# EAGLE board ES_Daisy_Patch_Rev8 (EAGLE 9.6.2), part 1 of 2
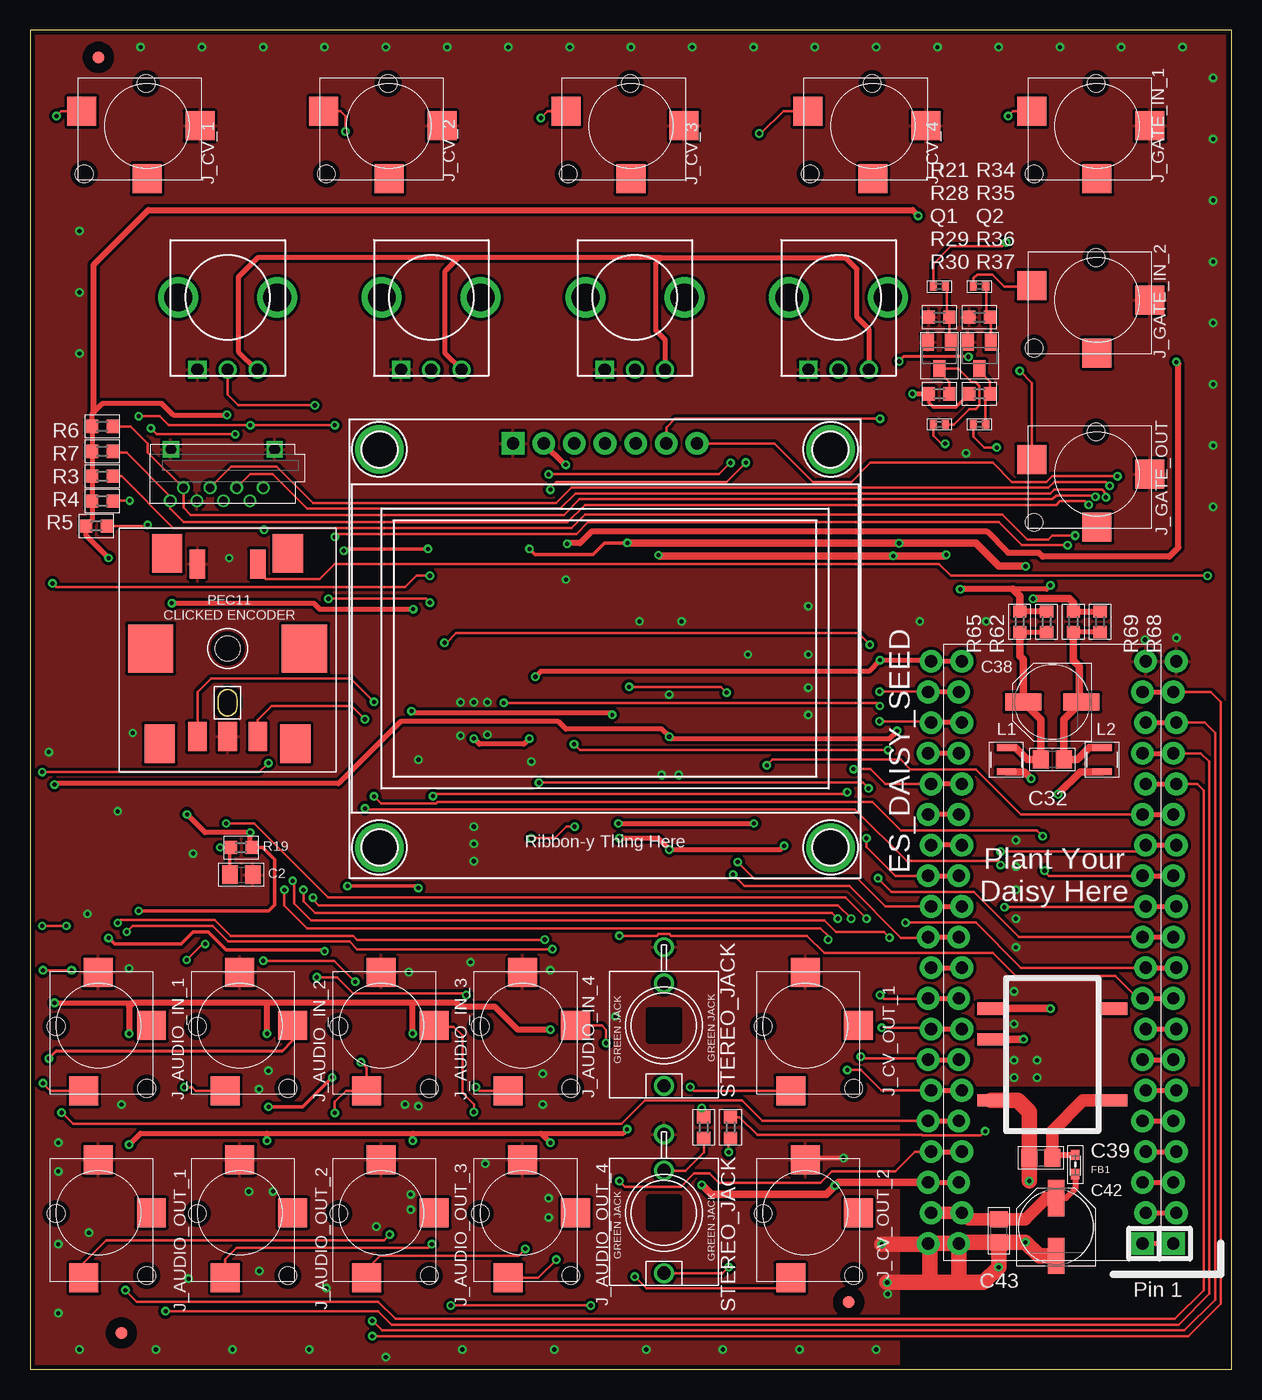
[diagram p4: board, top side]
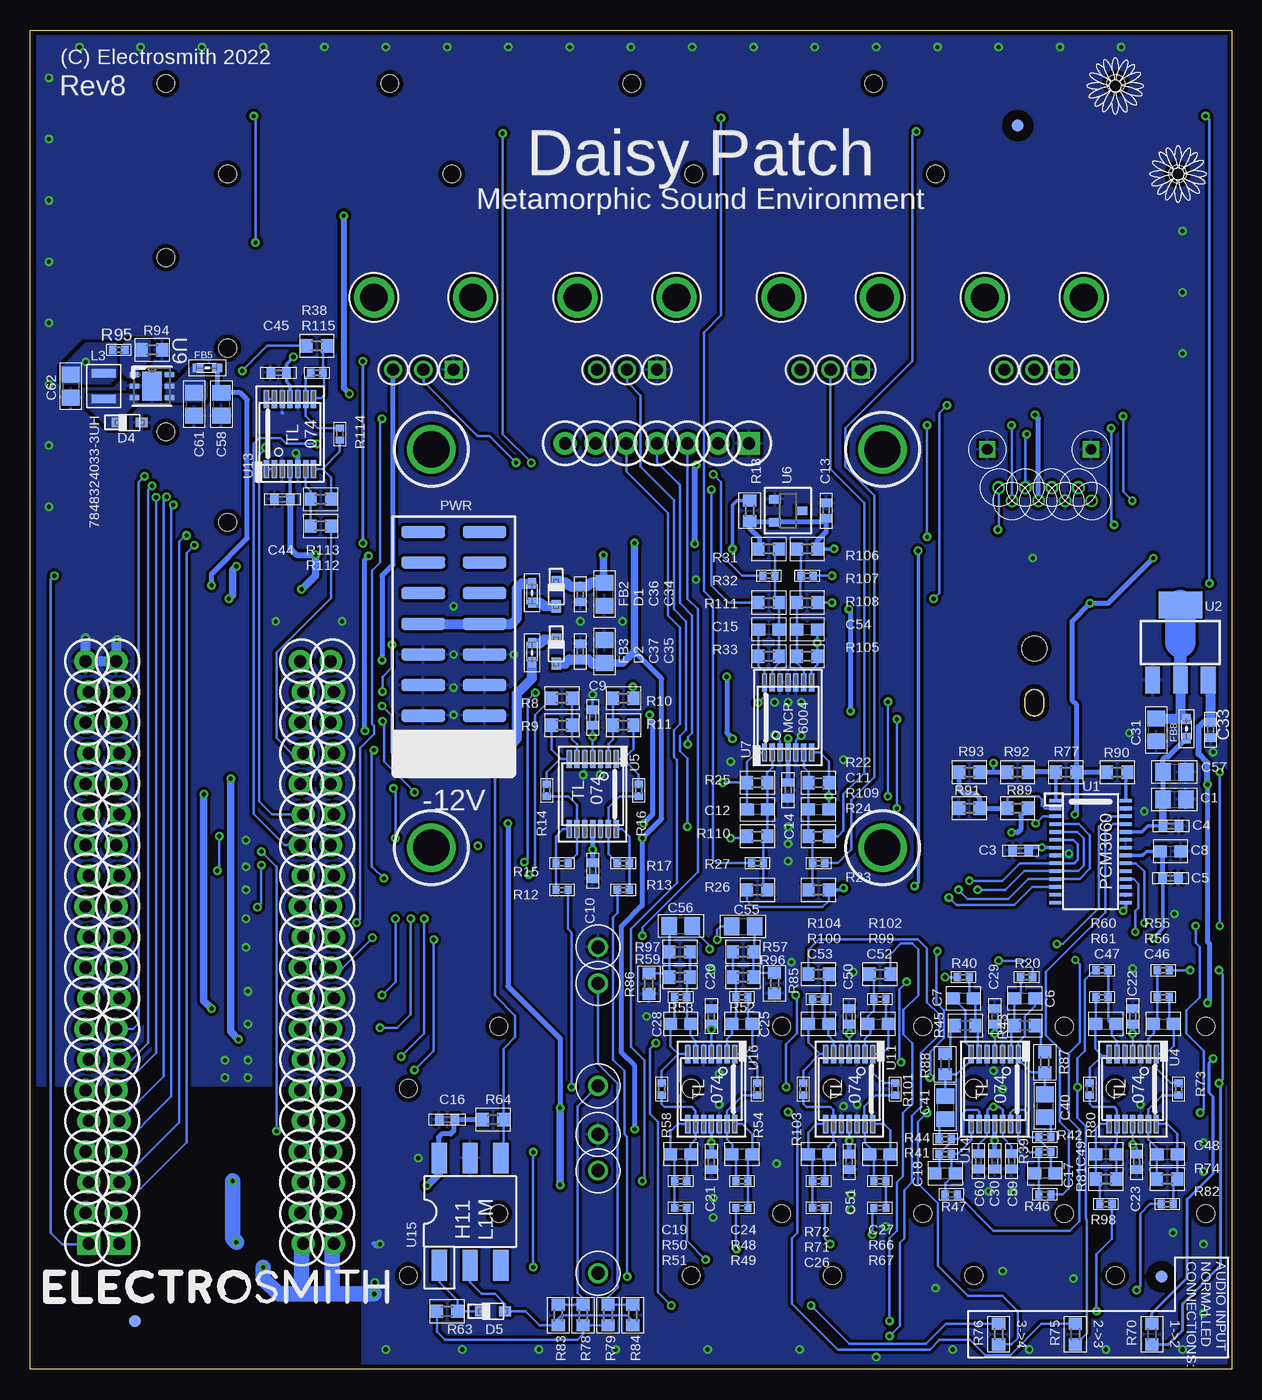
[diagram p5: board, bottom side, seen from below]

Size 99.6 x 111 mm. Coordinates in mm from the lower left corner, seen from the top.
Outline: 0,0 99.6,0 99.6,111 0,111 0,0
Copper layers (1*16): Top 0.0356mm / dielectric 1.5011mm / Bottom 0.0356mm
Design rules "ES_DRC_MaskedVias *": minimum track width 6mil, minimum drill 13mil, track to track 6mil, track to pad 6mil, pad to pad 6mil, via to via 6mil, smd to smd 6mil, copper to edge 15mil, drill to drill 6mil, minimum pad ring 7mil, minimum via ring 7mil, stop-mask expansion 3mil, vias tented up to drill 16mil, thermal gap 10mil
Net classes: 0 default: width 0.203 mm; 1 POWER: width 0.102 mm, clearance 0.102 mm; 7 CODEC: width 0.102 mm, drill 0.2 mm; 8 SAI: width 0.102 mm, drill 0.2 mm; 9 AGND: clearance 0.102 mm

## Footprints (pad centres in the part's own frame; a part is rotated, then mirrored left to right if it is on the bottom)
C0805 = smd 1.3 x 1.5: 1 -0.95,0; 2 0.95,0
C0402 = smd 0.7 x 0.9: 1 -0.65,0; 2 0.65,0
C0603 = smd 1.1 x 1: 1 -0.85,0; 2 0.85,0
PANASONIC_D = smd 3 x 1.4: + 2.4,0; - -2.4,0
SOD-323F = smd 1 x 0.8: A 1,0; C -1,0
VH1-147 = smd 1.55 x 2.4: A -2.5,-7.3; B 2.5,-7.3; C 0,-7.3 | smd 1.3 x 2.4: D -2.5,7; E 2.5,7 | smd 3.75 x 4: GND1 -6.375,0; GND2 6.375,0 | smd 2.5 x 3.2: GND3 -5.625,-7.9; GND4 5.625,-7.9; GND5 -5,7.9; GND6 5,7.9 | hole 2.05: 0,0
2X8_SMD_PWR = smd 3.642 x 1: 1 -2.54,8.89; 2 2.54,8.89; 3 -2.54,6.35; 4 2.54,6.35; 5 -2.54,3.81; 6 2.54,3.81; 7 -2.54,1.27; 8 2.54,1.27; 9 -2.54,-1.27; 10 2.54,-1.27; 11 -2.54,-3.81; 12 2.54,-3.81; 13 -2.54,-6.35; 14 2.54,-6.35; 15 -2.54,-8.89; 16 2.54,-8.89
WUERTH-ELEKTRONIK_0603 = smd 0.85 x 0.7: 1 -0.9,0; 2 0.7,0
FIDUCIAL_1MM = smd 1 x 1: 1 0,0
SMT_JACK = smd 2.4 x 2.4: 1 -4.4,0; 2 0,4.4; 3 5.4,-1.2 | hole 1.45: 5.2,4; 0.07,-3.5
STEREO_JACK_3.5MM = drill 1.1: GND 0,-6.5; RING 0,-3.5; TIP 0,5
BOURNS_SRP2010 = smd 0.559 x 1.6: P$1 -1.003,0; P$2 1.003,0
I1008 = smd 0.7 x 2: 1 1.05,0; 2 -1.05,0
SOT23-BEC = smd 1 x 1.4: B -0.95,-1.1; C 0,1.1; E 0.95,-1.1
R0603 = smd 1 x 1.1: 1 -0.85,0; 2 0.85,0
R0402 = smd 0.6 x 0.7: 1 -0.5,0; 2 0.5,0
TSSOP-28 = smd 0.305 x 0.991: 1 -4.225,-2.918; 2 -3.575,-2.918; 3 -2.925,-2.918; 4 -2.275,-2.918; 5 -1.625,-2.918; 6 -0.975,-2.918; 7 -0.325,-2.918; 8 0.325,-2.918; 9 0.975,-2.918; 10 1.625,-2.918; 11 2.275,-2.918; 12 2.925,-2.918; 13 3.575,-2.918; 14 4.225,-2.918; 15 4.225,2.918; 16 3.575,2.918; 17 2.925,2.918; 18 2.275,2.918; 19 1.625,2.918; 20 0.975,2.918; 21 0.325,2.918; 22 -0.325,2.918; 23 -0.975,2.918; 24 -1.625,2.918; 25 -2.275,2.918; 26 -2.925,2.918; 27 -3.575,2.918; 28 -4.225,2.918
SOT223 = smd 2.235 x 1.219: 1 3.099,-2.311; 2 3.099,0; 3 3.099,2.311 | smd 2.2 x 3.6: TAB -3.099,0
VERT_MICROSD_CENTERED = drill 0.9 square: GND1 -3.9,-1.55; GND2 4.7,-1.55 | drill 0.7: P$1 -2.95,1.62; P$2 -1.85,2.72; P$3 -0.75,1.62; P$4 0.35,2.72; P$5 1.45,1.62; P$6 2.55,2.72; P$7 3.65,1.62; P$8 4.75,2.72
TSSOP-14 = smd 0.45 x 1.5: 1 -1.95,-2.9; 2 -1.3,-2.9; 3 -0.65,-2.9; 4 0,-2.9; 5 0.65,-2.9; 6 1.3,-2.9; 7 1.95,-2.9; 8 1.95,2.9; 9 1.3,2.9; 10 0.65,2.9; 11 0,2.9; 12 -0.65,2.9; 13 -1.3,2.9; 14 -1.95,2.9
DBZ_R-PDSO-G3 = smd 0.7 x 1: 1 -0.95,-1.1; 2 0.95,-1.1; 3 0,1.1
DFN06_3X3_STM = smd 0.813 x 0.406: 1 -1.448,0.95; 2 -1.448,0; 3 -1.448,-0.95; 4 1.448,-0.95; 5 1.448,0; 6 1.448,0.95 | smd 1.6 x 2.413: 7 0,0
DIL06_GULLWING = smd 1.27 x 2.54: 1 -2.54,-4.445; 2 0,-4.445; 3 2.54,-4.445; 4 2.54,4.445; 5 0,4.445; 6 -2.54,4.445
XP_POWER_ISEXXXXA = smd 1 x 2.28: P$1 -3.81,-5.08; P$2 -1.27,-5.08; P$4 3.81,-5.08; P$5 3.81,5.08; P$8 -3.81,5.08
ES_DAISY_SEED_DOUBLE = drill 1.016 pad 1.88 square: 1 -7.493,24.13; B1 -10.033,24.13 | drill 1.016 pad 1.88: 2 -7.747,21.59; 3 -7.493,19.05; 4 -7.747,16.51; 5 -7.493,13.97; 6 -7.747,11.43; 7 -7.493,8.89; 8 -7.747,6.35; 9 -7.493,3.81; 10 -7.747,1.27; 11 -7.493,-1.27; 12 -7.747,-3.81; 13 -7.493,-6.35; 14 -7.747,-8.89; 15 -7.493,-11.43; 16 -7.747,-13.97; 17 -7.493,-16.51; 18 -7.747,-19.05; 19 -7.493,-21.59; 20 -7.747,-24.13; 21 7.493,-24.13; 22 7.747,-21.59; 23 7.493,-19.05; 24 7.747,-16.51; 25 7.493,-13.97; 26 7.747,-11.43; 27 7.493,-8.89; 28 7.747,-6.35; 29 7.493,-3.81; 30 7.747,-1.27; 31 7.493,1.27; 32 7.747,3.81; 33 7.493,6.35; 34 7.747,8.89; 35 7.493,11.43; 36 7.747,13.97; 37 7.493,16.51; 38 7.747,19.05; 39 7.493,21.59; 40 7.747,24.13; B2 -10.287,21.59; B3 -10.033,19.05; B4 -10.287,16.51; B5 -10.033,13.97; B6 -10.287,11.43; B7 -10.033,8.89; B8 -10.287,6.35; B9 -10.033,3.81; B10 -10.287,1.27; B11 -10.033,-1.27; B12 -10.287,-3.81; B13 -10.033,-6.35; B14 -10.287,-8.89; B15 -10.033,-11.43; B16 -10.287,-13.97; B17 -10.033,-16.51; B18 -10.287,-19.05; B19 -10.033,-21.59; B20 -10.287,-24.13; B21 10.033,-24.13; B22 10.287,-21.59; B23 10.033,-19.05; B24 10.287,-16.51; B25 10.033,-13.97; B26 10.287,-11.43; B27 10.033,-8.89; B28 10.287,-6.35; B29 10.033,-3.81; B30 10.287,-1.27; B31 10.033,1.27; B32 10.287,3.81; B33 10.033,6.35; B34 10.287,8.89; B35 10.033,11.43; B36 10.287,13.97; B37 10.033,16.51; B38 10.287,19.05; B39 10.033,21.59; B40 10.287,24.13
ER-OLEDM015-2 = drill 1.016 pad 1.88 square: 1 -7.62,17 | drill 1.016 pad 1.88: 2 -5.08,17; 3 -2.54,17; 4 0,17; 5 2.54,17; 6 5.08,17; 7 7.62,17 | drill 3 pad 4.013: MNT1 -18.7,16.5; MNT2 18.7,16.5; MNT3 -18.7,-16.5; MNT4 18.7,-16.5
PIP_POT_PASTE6 = drill 1 pad 1.422 square: 1 -2.5,-6 | drill 1 pad 1.422: 2 0,-6; 3 2.5,-6 | drill 2.3: S1 -4.1,0; S2 4.1,0

## Placement (x,y rotation side)
C1  10UF  [C0805]  4.75,47.25 0 bottom
C2  10UF  [C0805]  17.5,41 0 top
C3  100NF  [C0402]  17.5,43 180 bottom
C4  100NF  [C0402]  5.03,45.03 0 bottom
C5  100NF  [C0402]  5.07,40.72 0 bottom
C6  47PF  [C0603]  17.15,30.75 0 bottom
C7  47PF  [C0603]  22.25,30.75 180 bottom
C8  2.2UF  [C0603]  5.07,42.94 0 bottom
C9  100NF  [C0402]  52.98,54.03 90 bottom
C10  100NF  [C0402]  52.98,41.33 90 bottom
C11  10NF  [C0603]  34.24,46.41 0 bottom
C12  10NF  [C0603]  39.32,46.41 180 bottom
C13  100NF  [C0402]  33.61,71.17 90 bottom
C14  100NF  [C0402]  36.78,48 270 bottom
C15  10NF  [C0603]  38.37,61.33 180 bottom
C16  100NF  [C0402]  65.04,20.69 180 bottom
C17  47PF  [C0603]  15.5,16.25 180 bottom
C18  47PF  [C0603]  23.75,16.25 0 bottom
C19  47PF  [C0603]  45.67,17.83 180 bottom
C20  100NF  [C0402]  43.13,29.26 90 bottom
C21  100NF  [C0402]  43.13,17.2 90 bottom
C22  100NF  [C0402]  8.21,29.26 90 bottom
C23  100NF  [C0402]  7.89,17.2 90 bottom
C24  47PF  [C0603]  40.59,17.83 0 bottom
C25  47PF  [C0603]  40.59,28.63 0 bottom
C26  47PF  [C0603]  34.24,17.83 180 bottom
C27  47PF  [C0603]  29.16,17.83 0 bottom
C28  47PF  [C0603]  45.67,28.63 180 bottom
C29  100NF  [C0402]  19.64,29.26 90 bottom
C30  100NF  [C0402]  19.64,17.25 90 bottom
C31  10UF  [C0805]  6.25,53 270 bottom
C32  10UF  [C0805]  84.72,50.53 180 top
C33  100NF  [C0402]  1.75,53 270 bottom
C34  10UF  [C0805]  52,64.25 270 bottom
C35  10UF  [C0805]  52,59.5 270 bottom
C36  100NF  [C0402]  54,64.25 270 bottom
C37  100NF  [C0402]  54,59.5 270 bottom
C38  220uF  [PANASONIC_D]  84.72,55.3 180 top
C39  10UF  [C0805]  83.77,17.52 0 top
C40  10UF  [C0805]  15.5,21.85 270 bottom
C41  10UF  [C0805]  23.75,21.7 270 bottom
C42  220uF  [PANASONIC_D]  85.04,11.8 90 top
C43  10UF  [C0805]  80.28,11.48 90 top
C44  100NF  [C0402]  78.69,72.12 180 bottom
C45  100NF  [C0402]  79.01,82.6 0 bottom
C46  47PF  [C0603]  5.67,28.63 0 bottom
C47  47PF  [C0603]  10.44,28.63 180 bottom
C48  560PF  [C0603]  5.35,17.83 0 bottom
C49  560PF  [C0603]  10.43,17.83 180 bottom
C50  100NF  [C0402]  31.7,29.26 90 bottom
C51  100NF  [C0402]  31.7,17.2 90 bottom
C52  47PF  [C0603]  29.31,28.63 0 bottom
C53  47PF  [C0603]  34.24,28.63 180 bottom
C54  10NF  [C0603]  35.2,61.33 0 bottom
C55  10UF  [C0805]  40.5,36.7 0 bottom
C56  10UF  [C0805]  45.67,36.75 180 bottom
C57  10UF  [C0805]  4.75,49.5 0 bottom
C58  10UF  [C0805]  83.75,80 270 bottom
C59  100NF  [C0402]  18.25,17.25 270 bottom
C60  100NF  [C0402]  21,17.25 270 bottom
C61  10UF  [C0805]  86,80 270 bottom
C62  10UF  [C0805]  96.25,81.5 270 bottom
D1  NSR1020MW2T3G  [SOD-323F]  56,64.25 270 bottom
D2  NSR1020MW2T3G  [SOD-323F]  56,59.5 270 bottom
D4  NSR1020MW2T3G  [SOD-323F]  91.36,78.48 0 bottom
D5  1N4148  [SOD-323F]  61.23,4.81 0 bottom
ENC_1  ENCODER_SMT  [VH1-147]  16.36,59.75 0 top
EP1  EURORACK_POWERSMT_2X8  [2X8_SMD_PWR]  64.48,60.52 0 bottom
FB1  FB  [WUERTH-ELEKTRONIK_0603]  86.63,16.88 270 top
FB2  FB  [WUERTH-ELEKTRONIK_0603]  58,64.25 270 bottom
FB3  FB  [WUERTH-ELEKTRONIK_0603]  58,59.5 90 bottom
FB5  FB 0603  [WUERTH-ELEKTRONIK_0603]  85,83 180 bottom
FB8  FERRITE_BEAD_0603  [WUERTH-ELEKTRONIK_0603]  3.75,53 270 bottom
FD1  FIDUCIAL  [FIDUCIAL_1MM]  5.65,108.75 0 top
FD2  FIDUCIAL  [FIDUCIAL_1MM]  7.56,3.02 0 top
FD3  FIDUCIAL  [FIDUCIAL_1MM]  67.85,5.56 0 top
FD4  FIDUCIAL  [FIDUCIAL_1MM]  17.73,103.08 0 bottom
FD5  FIDUCIAL  [FIDUCIAL_1MM]  5.83,7.67 0 bottom
FD6  FIDUCIAL  [FIDUCIAL_1MM]  90.92,4.02 0 bottom
J_AUDIO_IN_1  EURO_JACK_SMT  [SMT_JACK]  5.65,28.5 270 top
J_AUDIO_IN_2  EURO_JACK_SMT  [SMT_JACK]  17.37,28.5 270 top
J_AUDIO_IN_3  EURO_JACK_SMT  [SMT_JACK]  29.09,28.5 270 top
J_AUDIO_IN_4  EURO_JACK_SMT  [SMT_JACK]  40.81,28.5 270 top
J_AUDIO_OUT_1  EURO_JACK_SMT  [SMT_JACK]  5.65,12.97 270 top
J_AUDIO_OUT_2  EURO_JACK_SMT  [SMT_JACK]  17.37,12.97 270 top
J_AUDIO_OUT_3  EURO_JACK_SMT  [SMT_JACK]  29.09,12.97 270 top
J_AUDIO_OUT_4  EURO_JACK_SMT  [SMT_JACK]  40.81,12.97 270 top
J_CV_1  EURO_JACK_SMT  [SMT_JACK]  9.69,103.07 180 top
J_CV_2  EURO_JACK_SMT  [SMT_JACK]  29.74,103.07 180 top
J_CV_3  EURO_JACK_SMT  [SMT_JACK]  49.8,103.07 180 top
J_CV_4  EURO_JACK_SMT  [SMT_JACK]  69.86,103.07 180 top
J_CV_OUT_1  EURO_JACK_SMT  [SMT_JACK]  64.25,28.5 270 top
J_CV_OUT_2  EURO_JACK_SMT  [SMT_JACK]  64.25,12.97 270 top
J_GATE_IN_1  EURO_JACK_SMT  [SMT_JACK]  88.42,103.07 180 top
J_GATE_IN_2  EURO_JACK_SMT  [SMT_JACK]  88.42,88.64 180 top
J_GATE_OUT  EURO_JACK_SMT  [SMT_JACK]  88.42,74.21 180 top
J_MIDI_IN  STEREO_JACK  [STEREO_JACK_3.5MM]  52.53,28.5 180 top
J_MIDI_OUT  STEREO_JACK  [STEREO_JACK_3.5MM]  52.53,12.97 180 top
L1  2.2uH  [BOURNS_SRP2010]  80.92,50.53 270 top
L2  2.2uH  [BOURNS_SRP2010]  88.85,50.53 270 top
L3  7848324033-3UH  [I1008]  93.5,81.5 270 bottom
Q1  MMBT3904  [SOT23-BEC]  75.36,84.03 180 top
Q2  MMBT3904  [SOT23-BEC]  78.69,84.03 180 top
R1  33R  [R0603]  55.83,20.06 270 top
R2  10R  [R0603]  58.05,20.06 90 top
R3  47K  [R0603]  5.99,74.03 180 top
R4  47K  [R0603]  5.99,71.97 180 top
R5  47K  [R0603]  5.49,69.9 180 top
R6  47K  [R0603]  5.99,78.16 180 top
R7  47K  [R0603]  5.99,76.09 180 top
R8  33K  [R0603]  55.52,55.61 180 bottom
R9  49K9  [R0603]  55.52,53.39 0 bottom
R10  33K  [R0603]  50.44,55.61 0 bottom
R11  49K9  [R0603]  50.44,53.39 180 bottom
R12  1K  [R0402]  55.52,39.74 180 bottom
R13  1K  [R0402]  50.44,39.74 0 bottom
R14  100K  [R0402]  56.78,48 90 bottom
R15  100K  [R0402]  55.52,41.96 0 bottom
R16  100K  [R0402]  49.16,48 90 bottom
R17  100K  [R0402]  50.44,41.96 180 bottom
R18  2K  [R0603]  39.96,71.17 90 bottom
R19  5R1  [R0603]  17.5,43.25 0 top
R20  100K  [R0402]  17,32.5 180 bottom
R21  100K  [R0402]  75.36,89.75 0 top
R22  66K5  [R0603]  34.24,48.63 0 bottom
R23  200K  [R0603]  34.24,39.74 180 bottom
R24  100K  [R0402]  34.24,41.96 180 bottom
R25  66K5  [R0603]  39.32,48.63 180 bottom
R26  200K  [R0603]  39.32,39.74 0 bottom
R27  100K  [R0402]  39.32,41.96 0 bottom
R28  1M  [R0603]  75.36,87.21 0 top
R29  10K  [R0603]  75.36,80.86 180 top
R30  1K  [R0402]  75.36,78.32 0 top
R31  200K  [R0603]  38.37,68 0 bottom
R32  100K  [R0402]  38.37,65.78 0 bottom
R33  66K5  [R0603]  38.37,59.11 180 bottom
R34  100K  [R0402]  78.69,89.75 0 top
R35  1M  [R0603]  78.69,87.21 0 top
R36  10K  [R0603]  78.69,80.86 180 top
R37  1K  [R0402]  78.69,78.32 0 top
R38  100R  [R0603]  75.83,84.83 0 bottom
R39  100K  [R0402]  15.5,18 180 bottom
R40  100K  [R0402]  22.25,32.5 0 bottom
R41  100K  [R0402]  23.75,17.85 0 bottom
R42  100K  [R0402]  15.5,19.25 180 bottom
R43  10K  [R0603]  17.15,28.5 0 bottom
R44  100K  [R0402]  23.75,19.1 0 bottom
R45  10K  [R0603]  22.1,28.5 180 bottom
R46  1K  [R0402]  15.5,14.5 0 bottom
R47  1K  [R0402]  23.25,14.5 0 bottom
R48  100K  [R0402]  40.59,15.61 0 bottom
R49  1K  [R0402]  40.59,13.39 180 bottom
R50  100K  [R0402]  45.67,15.61 180 bottom
R51  1K  [R0402]  45.67,13.39 0 bottom
R52  100K  [R0402]  40.59,30.85 0 bottom
R53  100K  [R0402]  45.67,30.85 180 bottom
R54  100K  [R0402]  39.32,23.23 270 bottom
R55  100K  [R0402]  5.67,33.07 180 bottom
R56  100K  [R0402]  5.67,30.85 0 bottom
R57  220K  [R0603]  40.5,34.6 0 bottom
R58  100K  [R0402]  47.26,23.23 270 bottom
R59  220K  [R0603]  45.75,32.5 180 bottom
R60  100K  [R0402]  10.75,33.07 0 bottom
R61  100K  [R0402]  10.75,30.85 180 bottom
R62  10R  [R0603]  84.25,61.97 270 top
R63  220R  [R0603]  65.04,4.81 180 bottom
R64  270R  [R0603]  61.23,20.69 0 bottom
R65  10R  [R0603]  82.03,61.97 270 top
R66  100K  [R0402]  29.16,15.61 0 bottom
R67  1K  [R0402]  29.16,13.39 180 bottom
R68  10R  [R0603]  88.69,61.97 270 top
R69  10R  [R0603]  86.47,61.97 270 top
R70  0R  [R0603]  6.62,2.91 270 bottom
R71  100K  [R0402]  34.24,15.61 180 bottom
R72  1K  [R0402]  34.24,13.39 0 bottom
R73  100K  [R0402]  4.4,23.23 270 bottom
R74  10K  [R0603]  5.35,15.77 0 bottom
R75  0R  [R0603]  12.97,2.91 270 bottom
R76  0R  [R0603]  19.32,2.91 270 bottom
R77  4K7  [R0603]  13.75,49.5 0 bottom
R78  DNI 0R  [R0603]  53.77,4.5 90 bottom
R79  0R  [R0603]  51.7,4.5 90 bottom
R80  100K  [R0402]  11.77,23.23 270 bottom
R81  10K  [R0603]  10.43,15.77 180 bottom
R82  1K  [R0402]  5.35,13.7 180 bottom
R83  0R  [R0603]  55.83,4.5 90 bottom
R84  DNI 0R  [R0603]  49.64,4.5 90 bottom
R85  47K  [R0603]  37.9,32 90 bottom
R86  47K  [R0603]  48.31,31.96 90 bottom
R87  510R  [R0603]  15.5,25.45 90 bottom
R88  510R  [R0603]  23.75,25.29 90 bottom
R89  4K7 DNI  [R0603]  17.75,46.5 0 bottom
R90  220K  [R0603]  9.5,49.5 0 bottom
R91  4K7  [R0603]  21.75,46.5 180 bottom
R92  0R DNI  [R0603]  17.75,49.5 180 bottom
R93  0R DNI  [R0603]  21.75,49.5 0 bottom
R94  33K  [R0603]  89.5,84.5 0 bottom
R95  100K  [R0402]  92.25,84.5 180 bottom
R96  15K  [R0603]  40.5,32.5 0 bottom
R97  15K  [R0603]  45.75,34.6 180 bottom
R98  1K  [R0402]  10.43,13.7 0 bottom
R99  100K  [R0402]  29.16,30.69 0 bottom
R100  100K  [R0402]  34.24,30.69 180 bottom
R101  100K  [R0402]  27.89,23.23 270 bottom
R102  10K  [R0603]  29.16,32.75 180 bottom
R103  100K  [R0402]  35.51,23.23 270 bottom
R104  10K  [R0603]  34.24,32.75 0 bottom
R105  66K5  [R0603]  35.2,59.11 0 bottom
R106  200K  [R0603]  35.2,68 180 bottom
R107  100K  [R0402]  35.2,65.78 180 bottom
R108  66K5  [R0603]  35.2,63.55 180 bottom
R109  66K5  [R0603]  34.24,44.19 180 bottom
R110  66K5  [R0603]  39.32,44.19 0 bottom
R111  66K5  [R0603]  38.37,63.55 0 bottom
R112  33K  [R0603]  75.52,69.9 0 bottom
R113  49K9  [R0603]  75.52,72.12 180 bottom
R114  100K  [R0402]  73.93,77.52 270 bottom
R115  100K  [R0402]  75.83,82.6 180 bottom
U1  PCM3060  [TSSOP-28]  11.7,42.92 270 bottom
U2  LD1117-5V  [SOT223]  4.25,60.25 270 bottom
U3  MICRO_SD_CARDCENTERED  [VERT_MICROSD_CENTERED]  16.36,74.7 180 top
U4  TL074  [TSSOP-14]  8.21,23.23 180 bottom
U5  TL074  [TSSOP-14]  52.98,47.68 180 bottom
U6  LM4040-10V  [DBZ_R-PDSO-G3]  36.78,71.17 270 bottom
U7  MCP6004  [TSSOP-14]  36.78,54.03 0 bottom
U9  ST1S03PUR  [DFN06_3X3_STM]  89.5,81.5 0 bottom
U11  TL074  [TSSOP-14]  31.7,23.23 180 bottom
U13  TL074  [TSSOP-14]  78.06,77.52 0 bottom
U14  TL074  [TSSOP-14]  19.64,23.23 180 bottom
U15  OPTOISOLATOR_H11L1M  [DIL06_GULLWING]  63.14,13.07 0 bottom
U16  TL074  [TSSOP-14]  43.13,23.23 180 bottom
U$1  U24V/5V DC/DC ISOLATOR  [XP_POWER_ISEXXXXA]  84.72,26.09 270 top
U$5  [ES_DAISY_LOGO_1]  9.66,106.37 0 bottom
U$6  [ES_DAISY_LOGO_1]  4.46,99.07 0 bottom
U$7  [ES_TEXT_3X30MM]  84.25,6.79 0 bottom
U_DAISY  ES_DAISY_SEED  [ES_DAISY_SEED_DOUBLE]  84.72,34.56 180 top
U_OLED  OLED_DISPLAY  [ER-OLEDM015-2]  47.65,59.75 0 top
VR_1  M-10K-B-D-PIP  [PIP_POT_PASTE6]  16.36,88.85 0 top
VR_2  M-10K-B-D-PIP  [PIP_POT_PASTE6]  33.25,88.85 0 top
VR_3  M-10K-B-D-PIP  [PIP_POT_PASTE6]  50.13,88.85 0 top
VR_4  M-10K-B-D-PIP  [PIP_POT_PASTE6]  67.01,88.85 0 top